# Altium project OMODRI.PrjPcb (part 3 of 5)

## Sheet OMODRI_EnDATEnc.SchDoc
size A3; Date: Not shown in title block; ApprovedBy: Not shown in title block; CheckedBy: Not shown in title block; Author: Not shown in title block; CompanyName: Not shown in title block; Engineer: Not shown in title block; Organization: Not shown in title block; Address1: Not shown in title block; Address2: Not shown in title block; Address3: Not shown in title block; Address4: Not shown in title block; DocumentNumber: 1; Revision: Use project parameter SCH_Rev; SheetNumber: 3; SheetTotal: 4; PageSetup: Record=PageOptions|CenterHorizontal=True|CenterVertical=True|PrintScale=1.00|XCorrection=1.00|YCorrection=1.00|PrintKind=0|BorderSize=5000000|LeftOffset=0|BottomOffset=0|Orientation=2|PaperLength=1000|PaperWidth=1000|Scale=100|PaperSource=15|PrintQuality=600|MediaType=1|DitherType=10|PaperKind=Letter|PrintScaleMode=1; CurrentTime: Not shown in title block; CurrentDate: Not shown in title block; Time: Not shown in title block; DocumentFullPathAndName: Not shown in title block; DocumentName: Not shown in title block; ModifiedDate: Not shown in title block; ImagePath: Not shown in title block
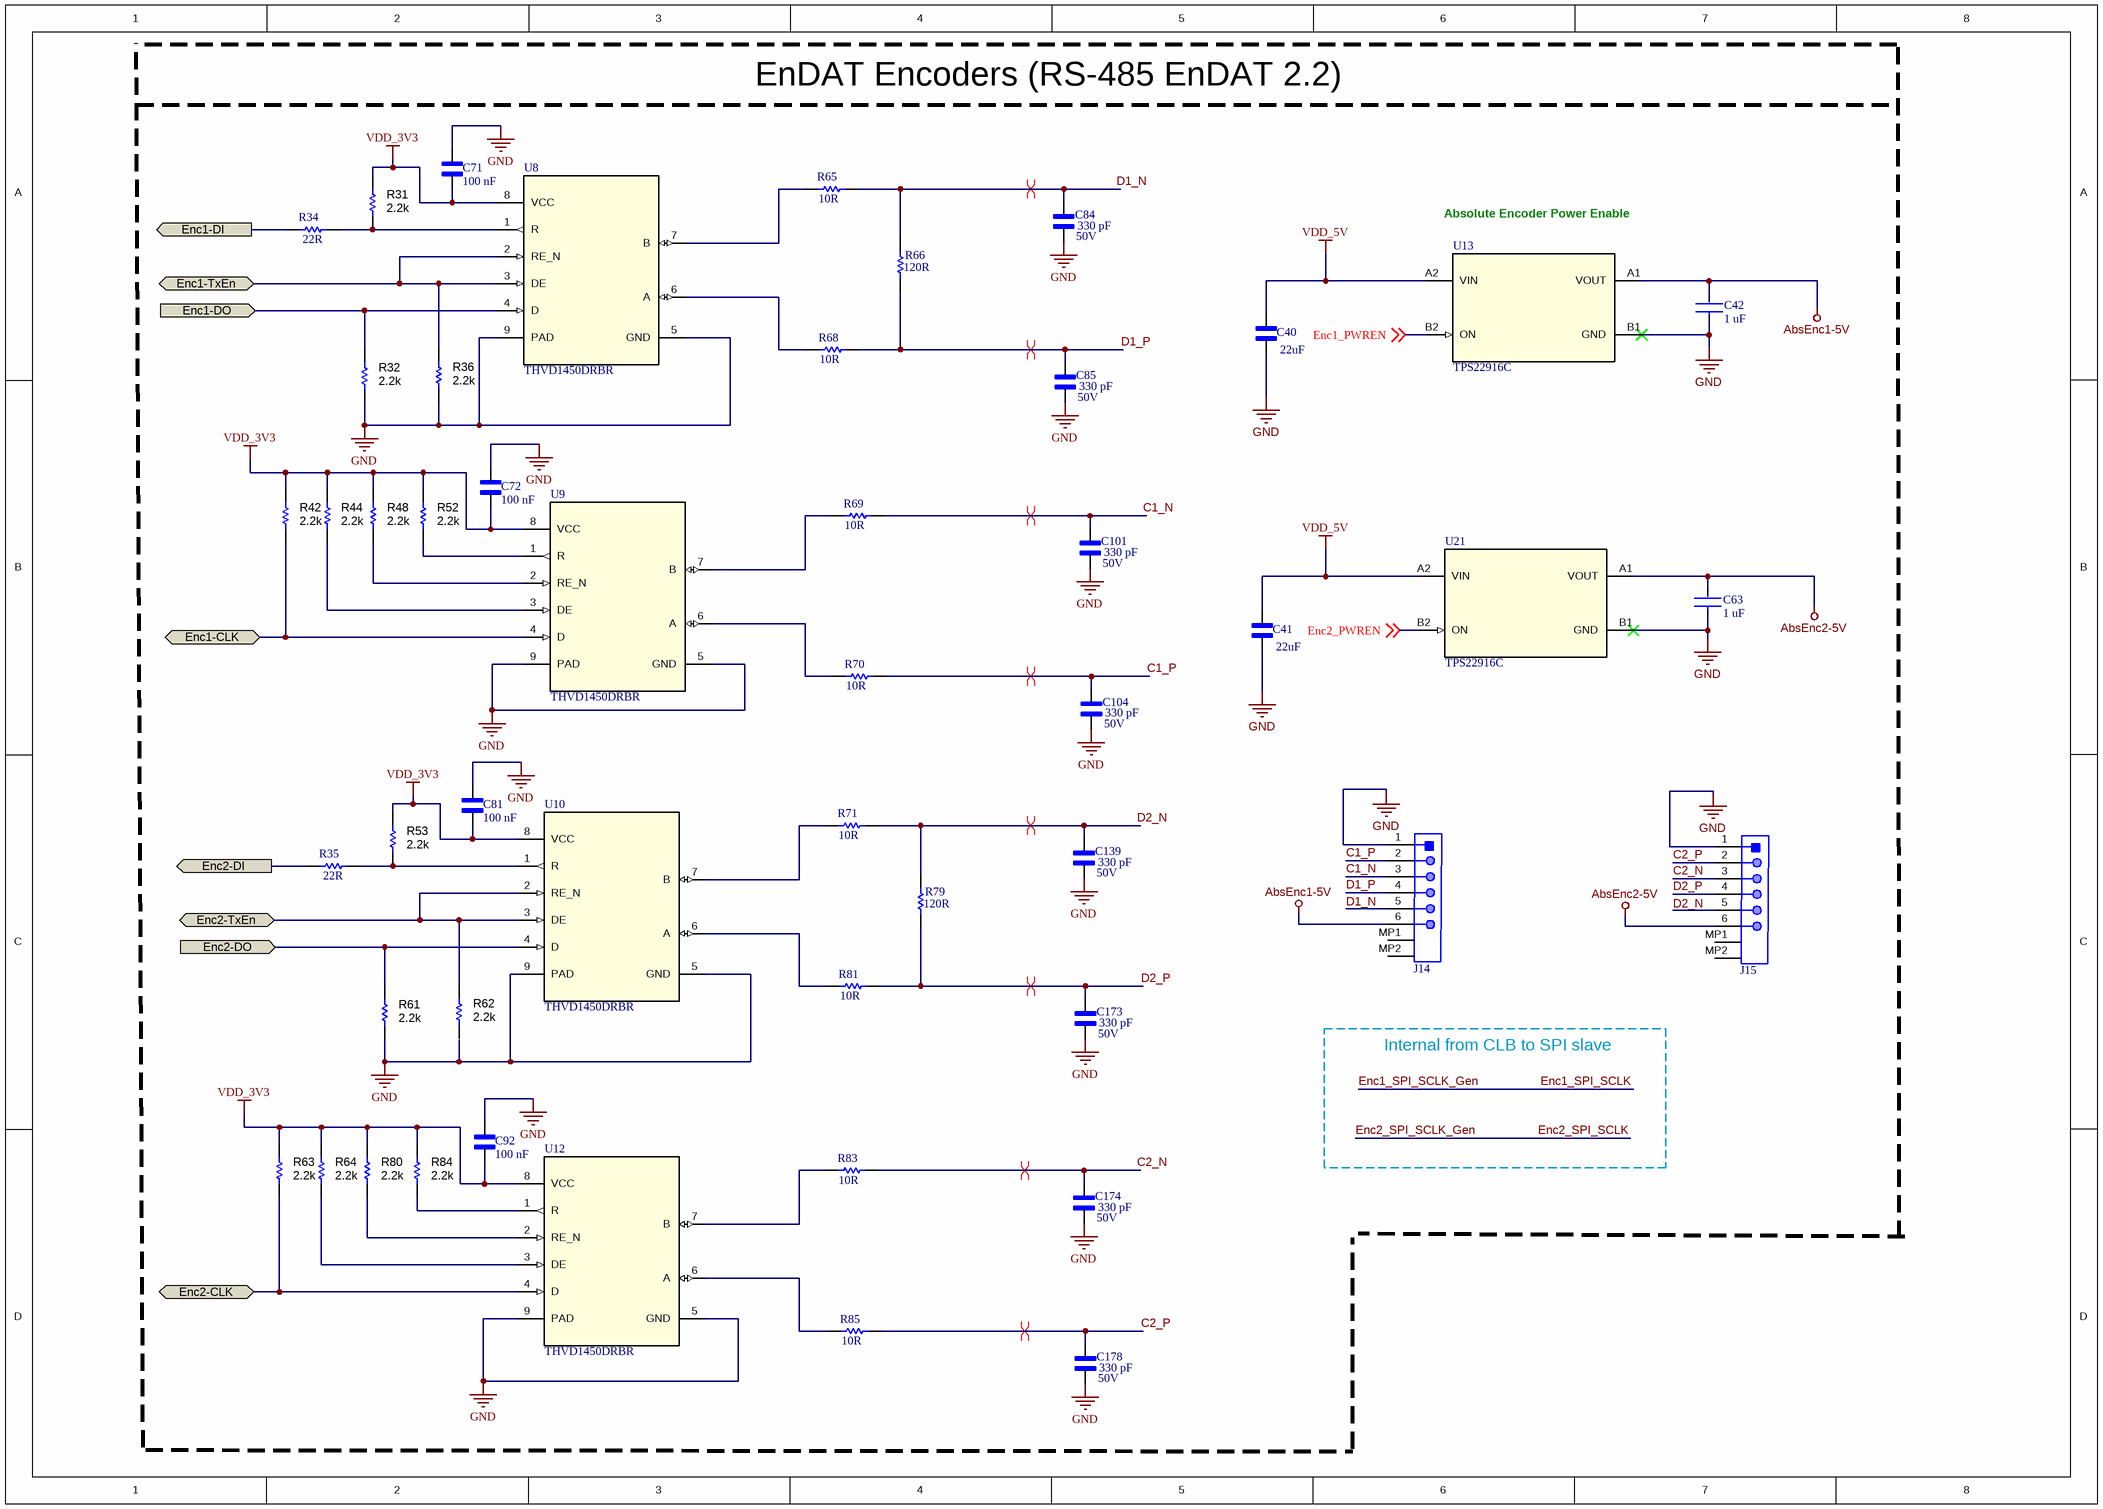
[diagram p4: OMODRI_EnDATEnc.SchDoc]

### Parts
C40  value 22uF  [CAPC1005X55N]  (hidden comment: CL05A226MQ5N6J8)
C41  value 22uF  [CAPC1005X55N]  (hidden comment: CL05A226MQ5N6J8)
C42  value 1 uF  [FP-CC0201-BA-MFG]  (hidden comment: CC0201MRX5R5BB105)
C63  value 1 uF  [FP-CC0201-BA-MFG]  (hidden comment: CC0201MRX5R5BB105)
C71  value 100 nF  [CAPC0603X33N]  (hidden comment: GRM033R61E104KE14D)
C72  value 100 nF  [CAPC0603X33N]  (hidden comment: GRM033R61E104KE14D)
C81  value 100 nF  [CAPC0603X33N]  (hidden comment: GRM033R61E104KE14D)
C84  value 330 pF  Voltage: 50V  [CAPC0603X33N]  (hidden comment: GRM033R71H331KA12D)
C85  value 330 pF  Voltage: 50V  [CAPC0603X33N]  (hidden comment: GRM033R71H331KA12D)
C92  value 100 nF  [CAPC0603X33N]  (hidden comment: GRM033R61E104KE14D)
C101  value 330 pF  Voltage: 50V  [CAPC0603X33N]  (hidden comment: GRM033R71H331KA12D)
C104  value 330 pF  Voltage: 50V  [CAPC0603X33N]  (hidden comment: GRM033R71H331KA12D)
C139  value 330 pF  Voltage: 50V  [CAPC0603X33N]  (hidden comment: GRM033R71H331KA12D)
C173  value 330 pF  Voltage: 50V  [CAPC0603X33N]  (hidden comment: GRM033R71H331KA12D)
C174  value 330 pF  Voltage: 50V  [CAPC0603X33N]  (hidden comment: GRM033R71H331KA12D)
C178  value 330 pF  Voltage: 50V  [CAPC0603X33N]  (hidden comment: GRM033R71H331KA12D)
J14  Conn_JST_BM06B-GHS-TBT_LF_SN_N_eec  [JST_BM06B-GHS-TBT_LF_SN_N_0]  (value not drawn)
J15  Conn_JST_BM06B-GHS-TBT_LF_SN_N_eec  [JST_BM06B-GHS-TBT_LF_SN_N_0]  (value not drawn)
R31  ValueDisplayed: 2.2k  [0402]  (hidden comment: CRCW04022K20JNED)
R32  ValueDisplayed: 2.2k  [0402]  (hidden comment: CRCW04022K20JNED)
R34  value 22R  [RESC1005X40X25ML05T05]  (hidden comment: ERJ-2GEJ220X)
R35  value 22R  [RESC1005X40X25ML05T05]  (hidden comment: ERJ-2GEJ220X)
R36  ValueDisplayed: 2.2k  [0402]  (hidden comment: CRCW04022K20JNED)
R42  ValueDisplayed: 2.2k  [0402]  (hidden comment: CRCW04022K20JNED)
R44  ValueDisplayed: 2.2k  [0402]  (hidden comment: CRCW04022K20JNED)
R48  ValueDisplayed: 2.2k  [0402]  (hidden comment: CRCW04022K20JNED)
R52  ValueDisplayed: 2.2k  [0402]  (hidden comment: CRCW04022K20JNED)
R53  ValueDisplayed: 2.2k  [0402]  (hidden comment: CRCW04022K20JNED)
R61  ValueDisplayed: 2.2k  [0402]  (hidden comment: CRCW04022K20JNED)
R62  ValueDisplayed: 2.2k  [0402]  (hidden comment: CRCW04022K20JNED)
R63  ValueDisplayed: 2.2k  [0402]  (hidden comment: CRCW04022K20JNED)
R64  ValueDisplayed: 2.2k  [0402]  (hidden comment: CRCW04022K20JNED)
R65  Resistance: 10R  [RESC1005X40X25ML05T10]  (hidden comment: CRCW040210R0FKEDHP)
R66  Resistance: 120R  [RESC1005X40X25ML05T10]  (hidden comment: CRCW0402120RJNEDHP)
R68  Resistance: 10R  [RESC1005X40X25ML05T10]  (hidden comment: CRCW040210R0FKEDHP)
R69  Resistance: 10R  [RESC1005X40X25ML05T10]  (hidden comment: CRCW040210R0FKEDHP)
R70  Resistance: 10R  [RESC1005X40X25ML05T10]  (hidden comment: CRCW040210R0FKEDHP)
R71  Resistance: 10R  [RESC1005X40X25ML05T10]  (hidden comment: CRCW040210R0FKEDHP)
R79  Resistance: 120R  [RESC1005X40X25ML05T10]  (hidden comment: CRCW0402120RJNEDHP)
R80  ValueDisplayed: 2.2k  [0402]  (hidden comment: CRCW04022K20JNED)
R81  Resistance: 10R  [RESC1005X40X25ML05T10]  (hidden comment: CRCW040210R0FKEDHP)
R83  Resistance: 10R  [RESC1005X40X25ML05T10]  (hidden comment: CRCW040210R0FKEDHP)
R84  ValueDisplayed: 2.2k  [0402]  (hidden comment: CRCW04022K20JNED)
R85  Resistance: 10R  [RESC1005X40X25ML05T10]  (hidden comment: CRCW040210R0FKEDHP)
U8  THVD1450DRBR  [DRB0008F]
U9  THVD1450DRBR  [DRB0008F]
U10  THVD1450DRBR  [DRB0008F]
U12  THVD1450DRBR  [DRB0008F]
U13  TPS22916C  [YFP0004ABAB]
U21  TPS22916C  [YFP0004ABAB]

### Ports
Enc1-CLK (bidir), Enc1-DI (out), Enc1-DO (in), Enc1-TxEn (bidir), Enc2-CLK (bidir), Enc2-DI (out), Enc2-DO (in), Enc2-TxEn (bidir)

### Nets
AbsEnc1-5V: C42.2 J14.6 U13.A1(VOUT)
AbsEnc2-5V: C63.2 J15.6 U21.A1(VOUT)
GND: C40.1 C41.1 C42.1 C63.1 C71.2 C72.2 C81.2 C84.1 C85.1 C92.2 C101.1 C104.1 C139.1 C173.1 C174.1 C178.1 J14.1 J15.1 R32.1 R61.1 U8.5(GND) U8.9(PAD) U9.5(GND) U9.9(PAD) U10.5(GND) U10.9(PAD) U12.5(GND) U12.9(PAD) U13.B1(GND) U21.B1(GND)
VDD_3V3: C71.1 C72.1 C81.1 C92.1 R31.2 R42.2 R44.2 R48.2 R52.2 R53.2 R63.2 R64.2 R80.2 R84.2 U8.8(VCC) U9.8(VCC) U10.8(VCC) U12.8(VCC)
VDD_5V: C40.2 C41.2 U13.A2(VIN) U21.A2(VIN)
C1_N: C101.2 J14.3 R69.2
C1_P: C104.2 J14.2 R70.2
C2_N: C174.2 J15.3 R83.2
C2_P: C178.2 J15.2 R85.2
D1_N: C84.2 R65.2 R66.2
D1_P: C85.2 J14.4 R66.1 R68.2
D2_N: C139.2 R71.2 R79.2
D2_P: C173.2 J15.4 R79.1 R81.2
Enc1_PWREN: U13.B2(ON) ; off-sheet Enc1_PWREN
Enc2_PWREN: U21.B2(ON) ; off-sheet Enc2_PWREN
NetC38_2: R42.1 U9.4(D) ; port Enc1-CLK
NetC68_2: R63.1 U12.4(D) ; port Enc2-CLK
NetR22_1: R34.1 ; port Enc1-DI
NetR31_1: R31.1 R34.2 U8.1(R)
NetR32_2: R32.2 U8.4(D) ; port Enc1-DO
NetR33_1: R35.1 ; port Enc2-DI
NetR35_2: R35.2 R53.1 U10.1(R)
NetR36_2: R36.2 U8.2(RE_N) U8.3(DE) ; port Enc1-TxEn
NetR44_1: R44.1 U9.3(DE)
NetR48_1: R48.1 U9.2(RE_N)
NetR52_1: R52.1 U9.1(R)
NetR61_2: R61.2 U10.4(D) ; port Enc2-DO
NetR62_2: R62.2 U10.2(RE_N) U10.3(DE) ; port Enc2-TxEn
NetR64_1: R64.1 U12.3(DE)
NetR65_1: R65.1 U8.7(B)
NetR68_1: R68.1 U8.6(A)
NetR69_1: R69.1 U9.7(B)
NetR70_1: R70.1 U9.6(A)
NetR71_1: R71.1 U10.7(B)
NetR80_1: R80.1 U12.2(RE_N)
NetR81_1: R81.1 U10.6(A)
NetR83_1: R83.1 U12.7(B)
NetR84_1: R84.1 U12.1(R)
NetR85_1: R85.1 U12.6(A)

Not connected (* = marked no-connect by the designer): J14 5 MP1 MP2; J15 5 MP1 MP2; R36 1; R62 1

### Layout directives
differential pair: C1_N, C1_P, C2_N, C2_P, D1_N, D1_P, D2_N, D2_P

### Notes on the sheet
- EnDAT Encoders (RS-485 EnDAT 2.2)
- Absolute Encoder Power Enable
- Internal from CLB to SPI slave
- Labels drawn without touching a wire or pin: D1_N, D2_N
- Drawn By:
- SVN Rev:
- Number:
- TID #:
- Orderable:
- Rev:
- Sheet Title:
- File:
- Project Title:
- Designed for:
- Assembly Variant:
- Mod. Date:
- Sheet:
- Size:
- of
- B
- http://www.ti.com
- Texas Instruments and/or its licensors do not warrant the accuracy or completeness of this specification or any information contained therein. Texas Instruments and/or its licensors do not warrant that this design will meet the specifications, will be suitable for your application or fit for any particular purpose, or will operate in an implementation. Texas Instruments and/or its licensors do not warrant that the design is production worthy. You should completely validate and test your design implementation to confirm the system functionality for your application.
- Engineer:
- Contact:
- © Texas Instruments

### Library data of the parts
C40 C41 = CL05A226MQ5N6J8: 22µF ±20% 6.3V Ceramic Capacitor X5R 0402 (1005 Metric); MF: Samsung Electro-Mechanics; Package: 0402 Samsung Electro-Mechanics; Availability: Unavailable; MP: CL05A226MQ5N6J8; DigiKey-Purchase-URL: https://snapeda.com/shop?store=DigiKey&id=3601912; SnapEDA_Link: https://www.snapeda.com/parts/CL05A226MQ5N6J8/Samsung%20Electro-Mechanics/view-part/3601912/?ref=snap; Price: None
C42 C63 = CMP-03422-000660-1: CAP CER 1UF 6.3V X5R 0201; Manufacturer: Yageo; Material: Ceramic; Tolerance: 0.2; Temperature Coefficient: 15%; Lead Free: Yes; Capacitance: 1 uF; ComponentLink2URL: http://www.yageo.com/documents/recent/UPY-GPHC_X5R_4V-to-50V_25.pdf; Footprint Url: http://www.yageo.com/exep/pages/download/literatures/UPY-C_GEN_24.pdf; Temperature Range Low: -55°C; Category: Cap; Device Class L3: Ceramic Capacitors; Device Class L2: Capacitors; Digikey Description: CAP CER 1UF 6.3V X5R 0201; Automotive: No; Temperature: -55°C to +85°C; RoHS: TRUE; Octopart: https://octopart.com/cc0201mrx5r5bb105-yageo-33242268; Height: 0.33mm; Temperature Range High: +85°C; Temperature Characteristic: X5R; Device Class L1: Passive Components; Package: CC0201-BA; ComponentLink2Description: Datasheet; Manufacturer Part Number: CC0201MRX5R5BB105; Voltage Rating: 6.3 V; Mouser Description: Multilayer Ceramic Capacitors MLCC - SMD/SMT 1.0uF 6.3V X5R 20%; Ipc Land Pattern Name: CAPC6030X30
C71 C72 C81 C92 = GRM033R61E104KE14D: SMD Capacitor X5R_EIA_ with Capacitance: 0.10uF Tol. 10%. Rated Voltage: 25Vdc; MF: Murata; SnapEDA_Link: https://www.snapeda.com/parts/GRM033R61E104KE14D/Murata/view-part/4375622/?ref=snap; Availability: Unavailable; MP: GRM033R61E104KE14D; Package: 0603 Taiyo Yuden; Price: None
C84 C85 C101 C104 C139 C173 C174 C178 = GRM033R71H331KA12D: SMD Capacitor X7R_EIA_ with Capacitance: 330pF Tol. 10%. Rated Voltage: 50Vdc; MF: Murata; MP: GRM033R71H331KA12D; SnapEDA_Link: https://www.snapeda.com/parts/GRM033R71H331KA12D/Murata/view-part/1976079/?ref=snap; Digi-Key_Purchase_URL: https://www.digikey.com/product-detail/en/murata-electronics/GRM033R71H331KA12D/490-17085-1-ND/7602084?utm_source=snapeda&utm_medium=aggregator&utm_campaign=symbol; Digi-Key_Part_Number: 490-17085-1-ND; Package: 0603 Taiyo Yuden
J14 J15 = Conn_JST_BM06B-GHS-TBT_LF_SN_N_eec: CONN HEADER GH TOP 6POS 1.25MM; Manufacturer: JST; Part Number: BM06B-GHS-TBT(LF)(SN)(N); helpURL: https://upverter.com/upn/revision/9caaf2120726c690/; ComponentLink2Description: Datasheet; Temperature: -25°C to +85°C; Package: HDR06; Supplier 2: Mouser; Price: 0.396190066284; Supplier 1: Digi-Key; ComponentLink1URL: https://upverter.com/upn/revision/9caaf2120726c690/; Supplier Part Number 1: 455-1582-1-ND; ComponentLink1Description: Upverter; ComponentLink2URL: http://www.jst-mfg.com/product/pdf/eng/eGH.pdf; RoHS: TRUE; Temperature Range High: +85°C; Digikey Description: CONN HEADER GH TOP 6POS 1.25MM; Digikey Part Number: 455-1582-1-ND; Temperature Range Low: -25°C; Lead Free: yes
R31 R32 R36 R42 R44 R48 R52 R53 R61-R64 R80 R84 = CMP-0026890-5: RES, 2.2 k, 5%, 0.063 W, AEC-Q200 Grade 0, 0402; Manufacturer: Vishay-Dale; Power_W: 63mW; TempCo: 200 ppm/C; Value_Code: 2k20; Value: 2.2k; EIA_Code: E24; SizeX_mm: 1; SizeY_mm: 0.5; SizeZ_mm: 0.6; Value2: 0.063W; AEC Qualified: Y; VDC_V: 50V; AEC Category: Q200; AEC Grade: 0; Supplier Part Number 2: 59M6710; Supplier 2: Newark; Supplier Part Number 3: 71-CRCW0402J-2.2K-E3; Supplier 3: Mouser; RoHS: E; Value1: 5%; MountType: SMT; Supplier 1: Digi-Key; PackageReference: 0402; Tolerance_%: 5%; Res_ohm: 2.2k; SizeArea_mm2: 0.5; CompType: Resistor; PartNumber: CRCW04022K20JNED; ComponentLink1Description: Datasheet link; Supplier Part Number 1: 541-2.2KJCT-ND; Technology: Thick Film; ComponentLink1URL: http://www.vishay.com/docs/20035/dcrcwe3.pdf
R34 R35 = CMP-2002-00486-1: Manufacturer: Panasonic; Part Number: ERJ-2GEJ220X
R65 R68-R71 R81 R83 R85 = CRCW040210R0FKEDHP: SMD Chip Resistor, 0402 [1005 Metric], 10 ohm, CRCW-HP e3 Series, 50 V, Thick Film, 200 mW; Manufacturer: Vishay Dale; Voltage Rating (DC): 50V; Temperature Coefficient: 100ppm/°C; Tolerance: 1%; Power Rating: 125mW; Part Number: CRCW040210R0FKEDHP; Supplier 1: Digi-Key; Manufacturer Part Number: CRCW040210R0FKEDHP; RoHS: Yes; Category: Chip SMD Resistors; Stock 1: 25822; Pricing 1: 1=0,14000, 10=0,12600, 100=0,04840, 1000=0,02130, 2500=0,01839, 5000=0,01646 (USD); Mount: Surface Mount; Case/Package: 0402; Weight: 2.3E-05oz; Contact Plating: Tin; Case Code (Imperial): 0402; Case Code (Metric): 1005; Min Operating Temperature: -55°C; Max Operating Temperature: 155°C; Packaging: Tape and Reel; Voltage Rating: 50V; Package Quantity: 10000; Termination: SMD/SMT; Composition: Thick Film; Military Standard: Not; Length: 1mm; Height: 0.3mm; Width: 0.5mm; Depth: 0.5mm; Radiation Hardening: No; Lead Free: Lead Free; REACH SVHC: Unknown; ComponentLink1URL: https://datasheet.ciiva.com/5542/crcwhpe3-46056-5542142.pdf?src-supplier=Mouser; ComponentLink1Description: https://datasheet.ciiva.com/5542/crcwhpe3-46056-5542142.pdf?src-supplier=Mouser; Supplier Part Number 1: 541-10.0YCT-ND
R66 R79 = CRCW0402120RJNEDHP: RES SMD 120 OHM 5% 1/5W 0402; Manufacturer: Vishay Dale; Power Rating: 125mW; Voltage Rating: 50V; Temperature Coefficient: 200ppm/°C; Part Number: CRCW0402120RJNEDHP; Supplier 1: Digi-Key; Manufacturer Part Number: CRCW0402120RJNEDHP; RoHS: Yes; Category: Chip SMD Resistors; Stock 1: 18750; Pricing 1: 1=0,13000, 10=0,11300, 100=0,04350, 1000=0,01912, 2500=0,01651, 5000=0,01477 (USD); Case/Package: 0402; Weight: 2.3E-05oz; Case Code (Metric): 1005; Case Code (Imperial): 0402; Min Operating Temperature: -55°C; Max Operating Temperature: 155°C; Package Quantity: 1; Tolerance: 5%; Packaging: Tape and Reel; Composition: Thick Film; Max Power Dissipation: 125mW; Features: Automotive AEC-Q200; Number of Terminations: 2; Termination: SMD/SMT; Military Standard: Not; Length: 1mm; Height: 0.016inch; Width: 0.02inch; Depth: 0.5mm; Lead Free: Lead Free; ComponentLink1URL: https://datasheet.ciiva.com/12577/crcwhpe3-46056-12577101.pdf?src-supplier=Mouser; ComponentLink1Description: https://datasheet.ciiva.com/12577/crcwhpe3-46056-12577101.pdf?src-supplier=Mouser; ComponentLink2URL: https://datasheet.ciiva.com/6548/crcwhpe3-6548111.pdf?src-supplier=Digi-Key; ComponentLink2Description: https://datasheet.ciiva.com/6548/crcwhpe3-6548111.pdf?src-supplier=Digi-Key; Supplier Part Number 1: 541-120YACT-ND
U8-U10 U12 = THVD1450DRBR: Manufacturer: Texas Instruments; Simplex/Duplex: Half Duplex; PartNumber: THVD1450DRBR; RefDes: RefDes; TYPE: TYPE; Value: Value; Supplier 1: Mouser; Manufacturer Part Number: THVD1450DRBR; RoHS: No; Stock 1: 8004; Pricing 1: 1=2,56000, 10=2,18000, 100=1,74000, 500=1,52000, 1000=1,26000, 3000=1,17000, 6000=1,13000, 9000=1,08000 (USD); Min Operating Temperature: -40°C; Max Operating Temperature: 125°C; Supplier Part Number 1: 595-THVD1450DRBR
U13 U21 = TPS22916C: TPS22916CY Single-Channel Ultra-Low Leakage Load Switch 2A 60 mO 1V to 5.5V 4-Pin DSBGA T/R; Manufacturer: Texas Instruments; Manufacturer Part Number: TPS22916CYFPR; Number of Channels: 1; Fault Protection: Reverse Current; Output Configuration: High Side; Supplier 1: Digi-Key; RoHS: No; Stock 1: 2282; Pricing 1: 1=0,42000, 10=0,36400, 25=0,33960, 100=0,25220, 250=0,21340, 500=0,20370, 1000=0,15035 (USD); Min Operating Temperature: -40°C; Max Operating Temperature: 85°C; Packaging: Tape and Reel; Number of Outputs: 1; Max Output Current: 2A; ComponentLink1URL: http://www.ti.com/lit/ds/symlink/tps22916.pdf?src-supplier=Digi-Key; ComponentLink1Description: http://www.ti.com/lit/ds/symlink/tps22916.pdf?src-supplier=Digi-Key; Supplier Part Number 1: 296-50065-1-ND

## Sheet OMODRI_EtherCAT_0.SchDoc
size A4
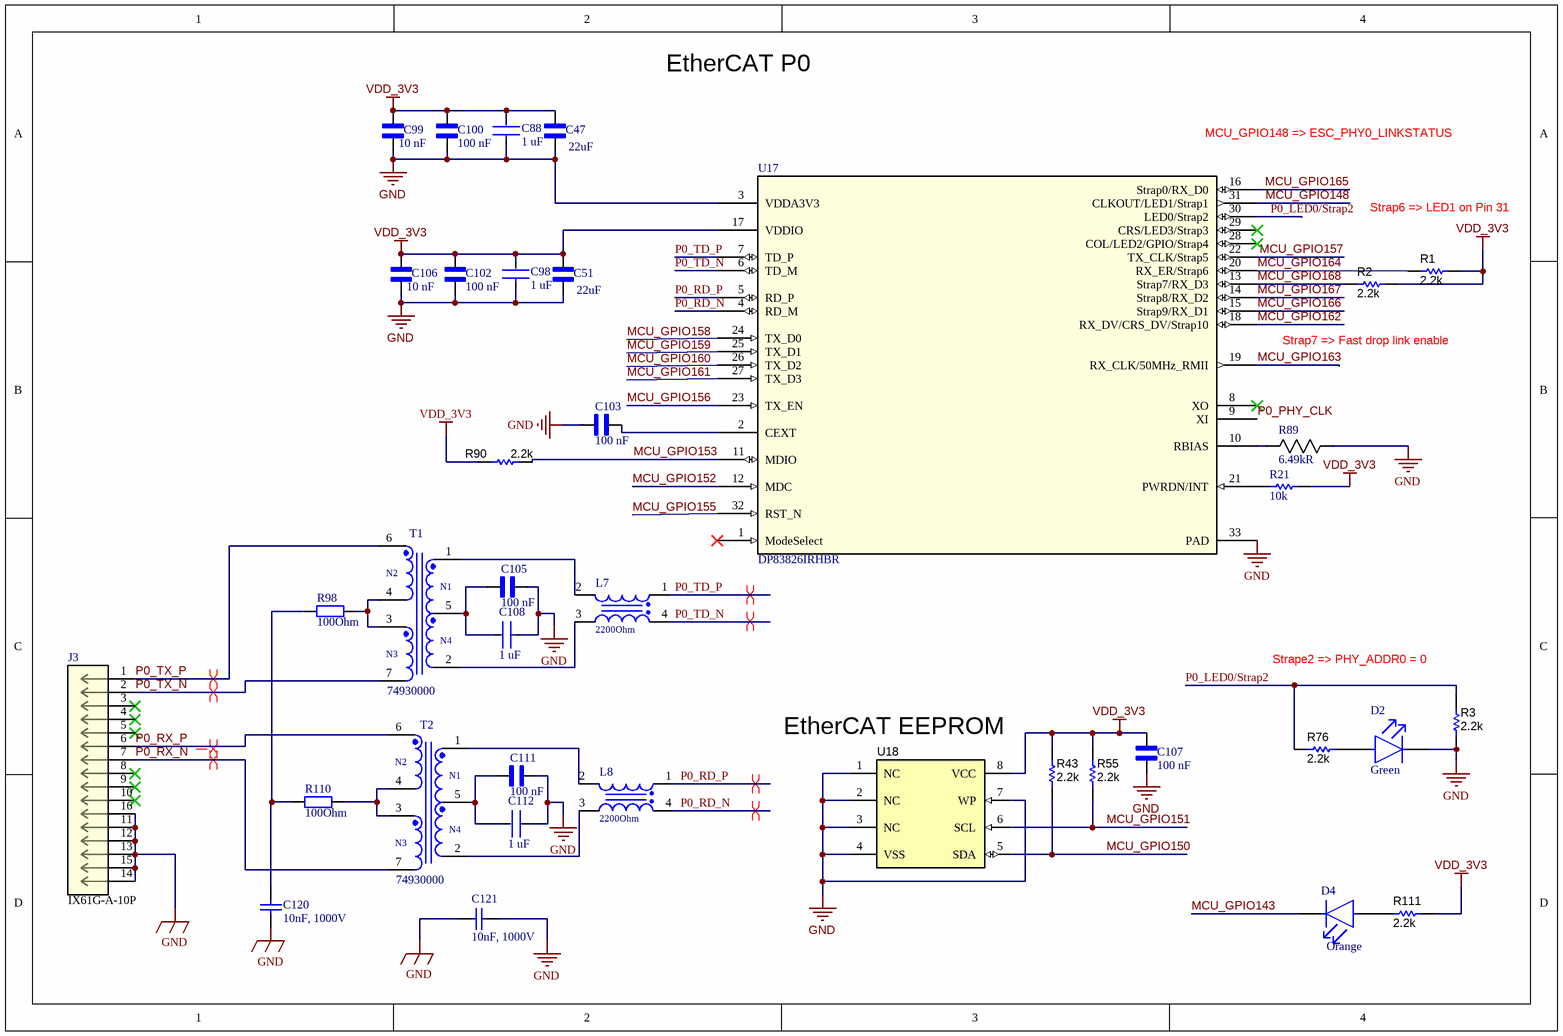
[diagram p5: OMODRI_EtherCAT_0.SchDoc]

### Parts
C47  value 22uF  [CAPC1005X55N]  (hidden comment: CL05A226MQ5N6J8)
C51  value 22uF  [CAPC1005X55N]  (hidden comment: CL05A226MQ5N6J8)
C88  value 1 uF  [FP-CC0201-BA-MFG]  (hidden comment: CC0201MRX5R5BB105)
C98  value 1 uF  [FP-CC0201-BA-MFG]  (hidden comment: CC0201MRX5R5BB105)
C99  value 10 nF  [CAPC0603X33N]  (hidden comment: GRM033R71E103KE14D)
C100  value 100 nF  [CAPC0603X33N]  (hidden comment: GRM033R61E104KE14D)
C102  value 100 nF  [CAPC0603X33N]  (hidden comment: GRM033R61E104KE14D)
C103  value 100 nF  [CAPC0603X33N]  (hidden comment: GRM033R61E104KE14D)
C105  value 100 nF  [CAPC0603X33N]  (hidden comment: GRM033R61E104KE14D)
C106  value 10 nF  [CAPC0603X33N]  (hidden comment: GRM033R71E103KE14D)
C107  value 100 nF  [CAPC0603X33N]  (hidden comment: GRM033R61E104KE14D)
C108  value 1 uF  [FP-CC0201-BA-MFG]  (hidden comment: CC0201MRX5R5BB105)
C111  value 100 nF  [CAPC0603X33N]  (hidden comment: GRM033R61E104KE14D)
C112  value 1 uF  [FP-CC0201-BA-MFG]  (hidden comment: CC0201MRX5R5BB105)
C120  10nF, 1000V  [WCAP-CSMH_1206_H=1.25mm]
C121  10nF, 1000V  [WCAP-CSMH_1206_H=1.25mm]
D2  Illumination Color: Green  [ROHM-SML-P11MT_V]  (hidden comment: SML-P11MTT86R)
D4  Color: Orange  [ROHM-SML-P11MT_V]  (hidden comment: SML-P11DTT86R)
J3  Part Number: IX61G-A-10P  [CONN_1G-A-10P]  (value not drawn)
L7  2200Ohm  [WE-CNSW_1206]
L8  2200Ohm  [WE-CNSW_1206]
R1  ValueDisplayed: 2.2k  [0402]  (hidden comment: CRCW04022K20JNED)
R2  ValueDisplayed: 2.2k  [0402]  (hidden comment: CRCW04022K20JNED)
R3  ValueDisplayed: 2.2k  [0402]  (hidden comment: CRCW04022K20JNED)
R21  Resistance: 10k  [RESC1005X40X25LL05T05]  (hidden comment: ERJ2RKF1002X)
R43  ValueDisplayed: 2.2k  [0402]  (hidden comment: CRCW04022K20JNED)
R55  ValueDisplayed: 2.2k  [0402]  (hidden comment: CRCW04022K20JNED)
R76  ValueDisplayed: 2.2k  [0402]  (hidden comment: CRCW04022K20JNED)
R89  Resistance: 6.49kR  [RES_CRCW_0402]  (hidden comment: Part Number: CRCW04026K49FKED)
R90  ValueDisplayed: 2.2k  [0402]  (hidden comment: CRCW04022K20JNED)
R98  100Ohm  [WRIS-KWKB_0612_H=0.55mm]
R110  100Ohm  [WRIS-KWKB_0612_H=0.55mm]
R111  ValueDisplayed: 2.2k  [0402]  (hidden comment: CRCW04022K20JNED)
T1  74930000  [74930000]
T2  74930000  [74930000]
U17  DP83826IRHBR  [RHB0032B]
U18  CAT24C16WI-GT3  [SOIC-8]  (value not drawn)

### Nets
GND: C47.1 C51.1 C88.1 C98.1 C99.1 C100.1 C102.1 C103.2 C105.1 C106.1 C107.2 C108.1 C111.1 C112.1 C120.1 C121.1 C121.2 D2.1(C) J3.11 J3.12 J3.13 J3.14 J3.15 J3.16 R3.2 R89.1 U17.3(VDDA3V3) U17.33(PAD) U18.1(NC) U18.2(NC) U18.3(NC) U18.4(VSS) U18.7(WP)
VDD_3V3: C47.2 C51.2 C88.2 C98.2 C99.2 C100.2 C102.2 C106.2 C107.1 R1.1 R2.1 R21.1 R43.1 R55.1 R90.2 R111.1 U17.17(VDDIO) U18.8(VCC)
MCU_GPIO143: D4.1(C)
MCU_GPIO148: U17.31(CLKOUT/LED1/Strap1)
MCU_GPIO150: R43.2 U18.5(SDA)
MCU_GPIO151: R55.2 U18.6(SCL)
MCU_GPIO152: U17.12(MDC)
MCU_GPIO153: R90.1 U17.11(MDIO)
MCU_GPIO155: U17.32(RST_N)
MCU_GPIO156: U17.23(TX_EN)
MCU_GPIO157: U17.22(TX_CLK/Strap5)
MCU_GPIO158: U17.24(TX_D0)
MCU_GPIO159: U17.25(TX_D1)
MCU_GPIO160: U17.26(TX_D2)
MCU_GPIO161: U17.27(TX_D3)
MCU_GPIO162: U17.18(RX_DV/CRS_DV/Strap10)
MCU_GPIO163: U17.19(RX_CLK/50MHz_RMII)
MCU_GPIO164: R1.2 U17.20(RX_ER/Strap6)
MCU_GPIO165: U17.16(Strap0/RX_D0)
MCU_GPIO166: U17.15(Strap9/RX_D1)
MCU_GPIO167: U17.14(Strap8/RX_D2)
MCU_GPIO168: R2.2 U17.13(Strap7/RX_D3)
P0_LED0/Strap2: R3.1 R76.2 U17.30(LED0/Strap2)
P0_PHY_CLK: U17.9(XI)
P0_RD_N: L8.4 U17.4(RD_M)
P0_RD_P: L8.1 U17.5(RD_P)
P0_RX_N: J3.7 T2.7
P0_RX_P: J3.6 T2.6
P0_TD_N: L7.4 U17.6(TD_M)
P0_TD_P: L7.1 U17.7(TD_P)
P0_TX_N: J3.2 T1.7
P0_TX_P: J3.1 T1.6
NetC103_1: C103.1 U17.2(CEXT)
NetC105_2: C105.2 C108.2 T1.5
NetC111_2: C111.2 C112.2 T2.5
NetC120_2: C120.2 R98.1 R110.1
NetD2_2: D2.2(A) R76.1
NetD4_2: D4.2(A) R111.2
NetL7_2: L7.2 T1.1
NetL7_3: L7.3 T1.2
NetL8_2: L8.2 T2.1
NetL8_3: L8.3 T2.2
NetR21_2: R21.2 U17.21(PWRDN/INT)
NetR89_2: R89.2 U17.10(RBIAS)
NetR98_2: R98.2 T1.3 T1.4
NetR110_2: R110.2 T2.3 T2.4

Not connected (* = marked no-connect by the designer): J3 3* 4* 5* 8* 9* 10*; U17 1(ModeSelect)* 8(XO)* 28(COL/LED2/GPIO/Strap4)* 29(CRS/LED3/Strap3)*

### Layout directives
differential pair: (no net found under the mark), P0_RD_N, P0_RD_P, P0_RX_N, P0_TD_N, P0_TD_P, P0_TX_N, P0_TX_P

### Notes on the sheet
- EtherCAT P0
- (near U17) MCU_GPIO148 => ESC_PHY0_LINKSTATUS
- Strap6 => LED1 on Pin 31
- Strap7 => Fast drop link enable
- Strape2 => PHY_ADDR0 = 0
- (near U18) EtherCAT EEPROM
- Sheet
- This document contains information which Wandercraft deems CONFIDENTIAL and PROPRIETARY; therefore, it shall not be used, duplicated, or disclosed in whole or in part without the prior written consent of Wandercraft.
- Reference number
- Version number
- Size A4
- /
- (in symbol 74930000) N2; N1; N4; N3

### Library data of the parts
C47 C51 = CL05A226MQ5N6J8: as C40 on sheet OMODRI_EnDATEnc; Package: 0402 Samsung Electro-Mechanics; Availability: Unavailable; MP: CL05A226MQ5N6J8; DigiKey-Purchase-URL: https://snapeda.com/shop?store=DigiKey&id=3601912; SnapEDA_Link: https://www.snapeda.com/parts/CL05A226MQ5N6J8/Samsung%20Electro-Mechanics/view-part/3601912/?ref=snap; Price: None
C88 C98 C108 C112 = CMP-03422-000660-1: as C42 on sheet OMODRI_EnDATEnc; Lead Free: Yes; Capacitance: 1 uF; ComponentLink2URL: http://www.yageo.com/documents/recent/UPY-GPHC_X5R_4V-to-50V_25.pdf; Footprint Url: http://www.yageo.com/exep/pages/download/literatures/UPY-C_GEN_24.pdf; Temperature Range Low: -55°C; Category: Cap; Device Class L3: Ceramic Capacitors; Device Class L2: Capacitors; Digikey Description: CAP CER 1UF 6.3V X5R 0201; Automotive: No; Temperature: -55°C to +85°C; RoHS: TRUE; Octopart: https://octopart.com/cc0201mrx5r5bb105-yageo-33242268; Height: 0.33mm; Temperature Range High: +85°C; Temperature Characteristic: X5R; Device Class L1: Passive Components; Package: CC0201-BA; ComponentLink2Description: Datasheet; Manufacturer Part Number: CC0201MRX5R5BB105; Voltage Rating: 6.3 V; Mouser Description: Multilayer Ceramic Capacitors MLCC - SMD/SMT 1.0uF 6.3V X5R 20%; Ipc Land Pattern Name: CAPC6030X30
C99 C106 = GRM033R71E103KE14D: SMD Capacitor X7R_EIA_ with Capacitance: 10000pF Tol. 10%. Rated Voltage: 25Vdc; MF: Murata; SnapEDA_Link: https://www.snapeda.com/parts/GRM033R71E103KE14D/Murata/view-part/4379447/?ref=snap; Package: 0603 Taiyo Yuden; MP: GRM033R71E103KE14D; Digi-Key_Purchase_URL: https://www.digikey.com/product-detail/en/murata-electronics/GRM033R71E103KE14D/490-14454-1-ND/6606915?utm_source=snapeda&utm_medium=aggregator&utm_campaign=symbol; Digi-Key_Part_Number: 490-14454-1-ND
C100 C102 C103 C105 C107 C111 = GRM033R61E104KE14D: as C71 on sheet OMODRI_EnDATEnc; SnapEDA_Link: https://www.snapeda.com/parts/GRM033R61E104KE14D/Murata/view-part/4375622/?ref=snap; Availability: Unavailable; MP: GRM033R61E104KE14D; Package: 0603 Taiyo Yuden; Price: None
C120 C121 = 885342208021: WCAP-CSMH Ceramic Capacitors, size 1206, 10nF, 1000VDC; Ceramic Type: X7R Class II; Dissipation Factor: 2.5%; Insulation Resistance: 10GOhm; Technical Reference: X7R1206103KA00DFCT10000; ComponentLink1Description: Manufacturer; ComponentLink1URL: http://www.we-online.de; ComponentLink2Description: Datasheet; ComponentLink2URL: https://katalog.we-online.com/pbs/datasheet/885342208021.pdf; Packaging: Tape and Reel; Part Number: 885342208021; Published Date: August 2019; Rated Voltage: 1000VDC; Size: 1206; Mounting Technology: SMD; Publisher: Wurth Elektronik; Capacitance: 10nF; Operating Temperature: -55 to +125degC
D2 = SML-P11MTT86R: LED Uni-Color Yellow Green 2-Pin Chip 0402(1006Metric) T/R; Manufacturer: Rohm; Lens Color: Colorless,Clear; Lens Style: Diffused,Colorless,Rectangular,Square,Clear; Number of LEDs: 1; Luminous Intensity: 2.1mcd; Forward Voltage: 1.9V; Wavelength: 569nm; Forward Current: 20mA; Test Current: 1mA; Lens Transparency: Clear; Viewing Angle: 150°; Power Rating: 54mW; Color: Green,Yellow; Supplier 1: Digi-Key; Manufacturer Part Number: SML-P11MTT86; RoHS: Yes; Category: LEDs; Stock 1: 6550; Pricing 1: 1=0,39000, 10=0,27200, 100=0,15890, 500=0,10896, 1000=0,09080, 2500=0,08172, 5000=0,07718 (USD); Mount: Surface Mount; Case/Package: 0402; Number of Pins: 2; Case Code (Imperial): 0402; Case Code (Metric): 1005; Min Operating Temperature: -40°C; Max Operating Temperature: 85°C; Packaging: Tape and Reel; Dominant Wavelength: 569nm; Package Quantity: 1; Length: 1mm; Height: 0.25mm; Width: 0.6mm; Radiation Hardening: No; REACH SVHC: No SVHC; Lead Free: Lead Free; ComponentLink1URL: https://datasheet.ciiva.com/5685/1738942-5685465.pdf?src-supplier=Farnell; ComponentLink1Description: https://datasheet.ciiva.com/5685/1738942-5685465.pdf?src-supplier=Farnell; ComponentLink2URL: https://datasheet.ciiva.com/11773/0900766b80df3ad7-11773737.pdf?src-supplier=RSComponents; ComponentLink2Description: https://datasheet.ciiva.com/11773/0900766b80df3ad7-11773737.pdf?src-supplier=RSComponents; ComponentLink3URL: https://datasheet.ciiva.com/16201/sml-p11mtt86-16201197.pdf?src-supplier=Future+Electronics; ComponentLink3Description: https://datasheet.ciiva.com/16201/sml-p11mtt86-16201197.pdf?src-supplier=Future+Electronics; ComponentLink4URL: https://datasheet.ciiva.com/2114/sml-p11-p-eco-2114983.pdf?src-supplier=Digi-Key; ComponentLink4Description: https://datasheet.ciiva.com/2114/sml-p11-p-eco-2114983.pdf?src-supplier=Digi-Key; ComponentLink5URL: https://datasheet.ciiva.com/2114/sml-p11-p-eco-2114984.pdf?src-supplier=Digi-Key; ComponentLink5Description: https://datasheet.ciiva.com/2114/sml-p11-p-eco-2114984.pdf?src-supplier=Digi-Key; ComponentLink6URL: https://datasheet.ciiva.com/2114/sml-p11-p-eco-2114985.pdf?src-supplier=Digi-Key; ComponentLink6Description: https://datasheet.ciiva.com/2114/sml-p11-p-eco-2114985.pdf?src-supplier=Digi-Key; ComponentLink7URL: https://datasheet.ciiva.com/4689/sml-p1-471200-4689502.pdf?src-supplier=Mouser; ComponentLink7Description: https://datasheet.ciiva.com/4689/sml-p1-471200-4689502.pdf?src-supplier=Mouser; ComponentLink8URL: https://datasheet.ciiva.com/29281/157928-da-01-en-led-0402-gelb-gruen-sml-p11mt-t86-29281338.pdf?src-supplier=Conrad; ComponentLink8Description: https://datasheet.ciiva.com/29281/157928-da-01-en-led-0402-gelb-gruen-sml-p11mt-t86-29281338.pdf?src-supplier=Conrad; Supplier Part Number 1: 511-1652-1-ND
D4 = SML-P11DTT86R: LED ORANGE CLEAR 1006 SMD; Manufacturer: Rohm; Lens Color: Colorless; Luminous Intensity: 7.3mcd; Test Current: 1mA; Dominant Wavelength: 605nm; Forward Voltage: 1.9V; Lens Style: Square,Diffused,Colorless; Number of LEDs: 1; Supplier 1: Digi-Key; Manufacturer Part Number: SML-P11DTT86R; RoHS: Yes; Category: LEDs; Stock 1: 2306; Pricing 1: 1=0,48000, 10=0,34300, 100=0,22400, 500=0,16100, 1000=0,12600, 2500=0,11550 (USD); Mount: Surface Mount; Case/Package: SMD/SMT; Number of Pins: 2; Lens Transparency: Clear; Forward Current: 1mA; Wavelength: 605nm; Packaging: Tape and Reel; Length: 1mm; Height: 0.25mm; Width: 0.6mm; REACH SVHC: Unknown; Lead Free: Lead Free; ComponentLink1URL: https://datasheet.ciiva.com/48679/sml-p11-p-eco-48679066.pdf?src-supplier=Avnet; ComponentLink1Description: https://datasheet.ciiva.com/48679/sml-p11-p-eco-48679066.pdf?src-supplier=Avnet; Supplier Part Number 1: SML-P11DTT86RCT-ND
J3 = IX61G-A-10P: Conn Ethernet Connector RCP 10 POS Solder RA Thru-Hole 10 Terminal 1 Port Cat 5e/Cat 6a Reel; Vendor: Hirose; Built_By: EMA_Matt; SourceLibrary: Hirose_12_20_2019; Connector Type: Receptacle; Number of Positions: 10; Manufacturer_Part_Number: IX61G-A-10P; Copyright: Copyright (C) 2018 Accelerated Designs. All rights reserved; RefDes: RefDes; Type: DEV; Value: Value; Supplier 1: Digi-Key; Manufacturer: Hirose; Manufacturer Part Number: IX61G-A-10P; RoHS: No; Category: Connectors; Stock 1: 3441; Pricing 1: 1=3,52000, 10=3,37900, 25=3,09760, 50=2,95680, 100=2,81600 (USD); Mount: Surface Mount; Contact Plating: Gold; Packaging: Tape and Reel; Termination: Solder; ComponentLink1URL: http://www.farnell.com/datasheets/2691134.pdf?src-supplier=Farnell; ComponentLink1Description: http://www.farnell.com/datasheets/2691134.pdf?src-supplier=Farnell; ComponentLink2URL: https://www.hirose.com/product/download/?distributor=digikey&amp;type=2d&amp;lang=en&amp;num=IX61G-A-10P&src-supplier=Digi-Key; ComponentLink2Description: https://www.hirose.com/product/download/?distributor=digikey&amp;type=2d&amp;lang=en&amp;num=IX61G-A-10P&src-supplier=Digi-Key; Supplier Part Number 1: H125667CT-ND
L7 L8 = 744232222: WE-CNSW SMT Common Mode Line Filter, size 1206, 2200Ohm, 0.2A, 50V; Manufacturer: Wurth Elektronik; DC Resistance max.: 1.2Ohm; Impedance Test Condition: 100MHz; Insulation Test Voltage: 125VAC; Winding Style: bifiliar; ComponentLink1Description: Manufacturer; ComponentLink1URL: http://www.we-online.de; ComponentLink2Description: Datasheet; ComponentLink2URL: https://www.we-online.com/catalog/datasheet/744232222.pdf; Operating Temperature: -40 to +125degC; Packaging: Tape and Reel; Published Date: April 2020; Rated Current: 0.2A; Size: 1206; Impedance: 2200Ohm; Manufacturer Part Number: 744232222; Rated Voltage: 50V; Mounting Technology: SMT
R1-R3 R43 R55 R76 R90 R111 = CMP-0026890-5: as R31 on sheet OMODRI_EnDATEnc; Supplier Part Number 2: 59M6710; Supplier 2: Newark; Supplier Part Number 3: 71-CRCW0402J-2.2K-E3; Supplier 3: Mouser; RoHS: E; Value1: 5%; MountType: SMT; Supplier 1: Digi-Key; PackageReference: 0402; Tolerance_%: 5%; Res_ohm: 2.2k; SizeArea_mm2: 0.5; CompType: Resistor; PartNumber: CRCW04022K20JNED; ComponentLink1Description: Datasheet link; Supplier Part Number 1: 541-2.2KJCT-ND; Technology: Thick Film; ComponentLink1URL: http://www.vishay.com/docs/20035/dcrcwe3.pdf
R21 = CMP-2000-07588-1: Chip Resistor, 10 KOhm, +/- 1%, 0.1 W, -55 to 155 degC, 0402 (1005 Metric), RoHS, Tape and Reel; Manufacturer: Panasonic; Power Rating: 100mW; Voltage Rating: 50V; Case\/Package: 0402; Temperature Coefficient: 100ppm\/degreesC; RoHSCompliant: True; Lead Free: LeadFree; Package Quantity: 1; Contact Plating: Tin; Length: 1mm; Radiation Hardening: No; REACH SVHC: NoSVHC; Max Operating Temperature: 155degC; Depth: 0.5mm; Case Code (Imperial): 0402; Military Standard: Not; Package Description: 2-Pin Surface Mount Device, Body 1 x 0.5 mm; Termination: SMD/SMT; Case Code (Metric): 1005; Height: 0.35mm; Packaging: TapeandReel; Voltage Rating (DC): 50V; Package Reference: 402; Number of Pins: 2; Tolerance: 1%; Mounting Technology: SurfaceMount; Width: 0.02inch; Mount: SurfaceMount; Datasheet URL: https://industrial.panasonic.com/cdbs/www-data/pdf/RDA0000/AOA0000C304.pdf; Composition: ThickFilm; Datasheet Version: 02/2017; Manufacturer URL: http://www.panasonic.com/; Max Power Dissipation: 100mW; Number of Terminations: 2; Min Operating Temperature: -55degC
R89 = CRCW04026K49FKED: Res Thick Film 0402 6.49K Ohm 1% 0.063W(1/16W) ±100ppm/C Pad SMD Automotive T/R; Vendor: Vishay; Built_By: EMA_UL_Team; Temperature Coefficient: 100ppm/°C; Power Rating: 63mW; Voltage Rating: 50V; Manufacturer_Part_Number: CRCW04026K49FKED; Copyright: Copyright (C) 2018 Accelerated Designs. All rights reserved; RefDes: RefDes; Type: DEV; Value: Value; Supplier 1: Digi-Key; Manufacturer: Vishay; Manufacturer Part Number: CRCW04026K49FKED; RoHS: Yes; Category: Chip SMD Resistors; Stock 1: 24052; Pricing 1: 1=0,10000, 10=0,03600, 100=0,01460, 1000=0,00657, 2500=0,00570, 5000=0,00471 (USD); Mount: Surface Mount; Case/Package: 0402; Number of Pins: 2; Weight: 2.3E-05oz; Contact Plating: Tin; Case Code (Metric): 1005; Case Code (Imperial): 0402; Min Operating Temperature: -55°C; Max Operating Temperature: 155°C; Composition: Thick Film; Packaging: Tape and Reel; Package Quantity: 10; Number of Terminations: 2; Max Power Dissipation: 63mW; Voltage Rating (DC): 50V; Military Standard: Not; Termination: SMD/SMT; Features: Automotive AEC-Q200; Length: 1mm; Height: 0.35mm; Width: 0.02inch; Depth: 0.5mm; Radiation Hardening: No; Lead Free: Lead Free; REACH SVHC: Unknown; ComponentLink1URL: https://datasheet.ciiva.com/11818/0900766b80d98824-11818134.pdf?src-supplier=RSComponents; ComponentLink1Description: https://datasheet.ciiva.com/11818/0900766b80d98824-11818134.pdf?src-supplier=RSComponents; ComponentLink2URL: https://datasheet.ciiva.com/2463/dcrcwe3-2463233.pdf?src-supplier=Digi-Key; ComponentLink2Description: https://datasheet.ciiva.com/2463/dcrcwe3-2463233.pdf?src-supplier=Digi-Key; ComponentLink3URL: https://datasheet.ciiva.com/2463/dcrcwe3-2463234.pdf?src-supplier=Digi-Key; ComponentLink3Description: https://datasheet.ciiva.com/2463/dcrcwe3-2463234.pdf?src-supplier=Digi-Key; ComponentLink4URL: https://datasheet.ciiva.com/5551/dcrcwe3-109170-5551783.pdf?src-supplier=Mouser; ComponentLink4Description: https://datasheet.ciiva.com/5551/dcrcwe3-109170-5551783.pdf?src-supplier=Mouser; ComponentLink5URL: https://datasheet.ciiva.com/7679/1697337-7679082.pdf?src-supplier=Element14; ComponentLink5Description: https://datasheet.ciiva.com/7679/1697337-7679082.pdf?src-supplier=Element14; ComponentLink6URL: https://datasheet.ciiva.com/7679/1697337-7679258.pdf?src-supplier=Element14; ComponentLink6Description: https://datasheet.ciiva.com/7679/1697337-7679258.pdf?src-supplier=Element14; ComponentLink7URL: https://datasheet.ciiva.com/2463/dcrcwe3-2463232.pdf?src-supplier=Digi-Key; ComponentLink7Description: https://datasheet.ciiva.com/2463/dcrcwe3-2463232.pdf?src-supplier=Digi-Key; Supplier Part Number 1: 541-6.49KLCT-ND; Tolerance: 1%
R98 R110 = 561020132009: WRIS-KWKB Thick Film Resistors, size 0612, 100Ohm, +/-5%, 0.75W; Rated Current: 86.6mA; Temperature Coefficient of Resistance: +/-200ppm/degC; Technical Reference: KB06121000J304DAATP0000; ComponentLink1Description: Manufacturer; ComponentLink1URL: http://www.we-online.de; ComponentLink2Description: Datasheet; ComponentLink2URL: https://katalog.we-online.com/pbs/datasheet/561020132009.pdf; Publisher: Wurth Elektronik; Rated Power: 0.75W; Resistance: 100Ohm; Mounting Technology: SMT; Height: 0.55mm; Part Number: 561020132009; Packaging: Tape and Reel; Published Date: September 2019; Size: 0612; Length: 1.6mm; Operating Temperature: -55 to +155degC; Resistance Tolerance: +/-5%; Width: 3.2mm
T1 T2 = 74930000: WE-STST Super Tiny Signal Transformer, size 4532, 350uH; Insulation Test Voltage: 1500VRMS; Turns Ratio: 1:1; ComponentLink1Description: Manufacturer; ComponentLink1URL: http://www.we-online.de; ComponentLink2Description: Datasheet; ComponentLink2URL: https://katalog.we-online.com/pbs/datasheet/74930000.pdf; Packaging: Tape and Reel; Publisher: Wurth Elektronik; Size: 4532; Inductance: 350uH; Mounting Technology: SMT; Operating Temperature: -40 to +105degC; Part Number: 74930000; Published Date: November 2019
U17 = DP83826IRHBR: Low latency 10/100-Mbps PHY, MII interface and enhanced mode with an industrial temperature range 32-VQFN -40 to 85; Manufacturer: Texas Instruments; Supplier 1: Avnet; Manufacturer Part Number: DP83826IRHBR; Pricing 1: 3000=1,00750, 6000=0,96850, 12000=0,92300, 18000=0,89700, 24000=0,86450 (USD); ComponentLink1URL: https://octopart.com/click/track?ai=8629&ct=datasheets&sig=00cfb32&at=physicalpart&sid=370&ppid=108112645&hlid=29178382&src-supplier=TI+store; ComponentLink1Description: https://octopart.com/click/track?ai=8629&ct=datasheets&sig=00cfb32&at=physicalpart&sid=370&ppid=108112645&hlid=29178382&src-supplier=TI+store; Supplier Part Number 1: DP83826IRHBR
U18 = CMP-0082059-1: 16 Kb I2C EEPROM Serial, SOIC-8; Manufacturer: ON Semiconductor; SizeArea_mm2: 29.351; SizeAreaWB_mm2: 55.131; SizeY_mm: 4.9; SizeZ_mm: 1.75; SizeX_mm: 5.99; PartNumber: CAT24C16WI-GT3; Supplier Part Number 2: 23AC2979; Supplier 3: Mouser; PackageReference: SOIC-8; Supplier Part Number 1: CAT24C16WI-GT3CT-ND; ComponentLink1Description: Datasheet URL; MountType: SMT; ComponentLink1URL: https://www.onsemi.com/pub/Collateral/CAT24C01-D.PDF; Supplier 1: Digi-Key; RoHS: Y; Supplier 2: Newark; Supplier Part Number 3: 698-CAT24C16WI-GT3